# EAGLE schematic PROG (EAGLE 9.5.2)
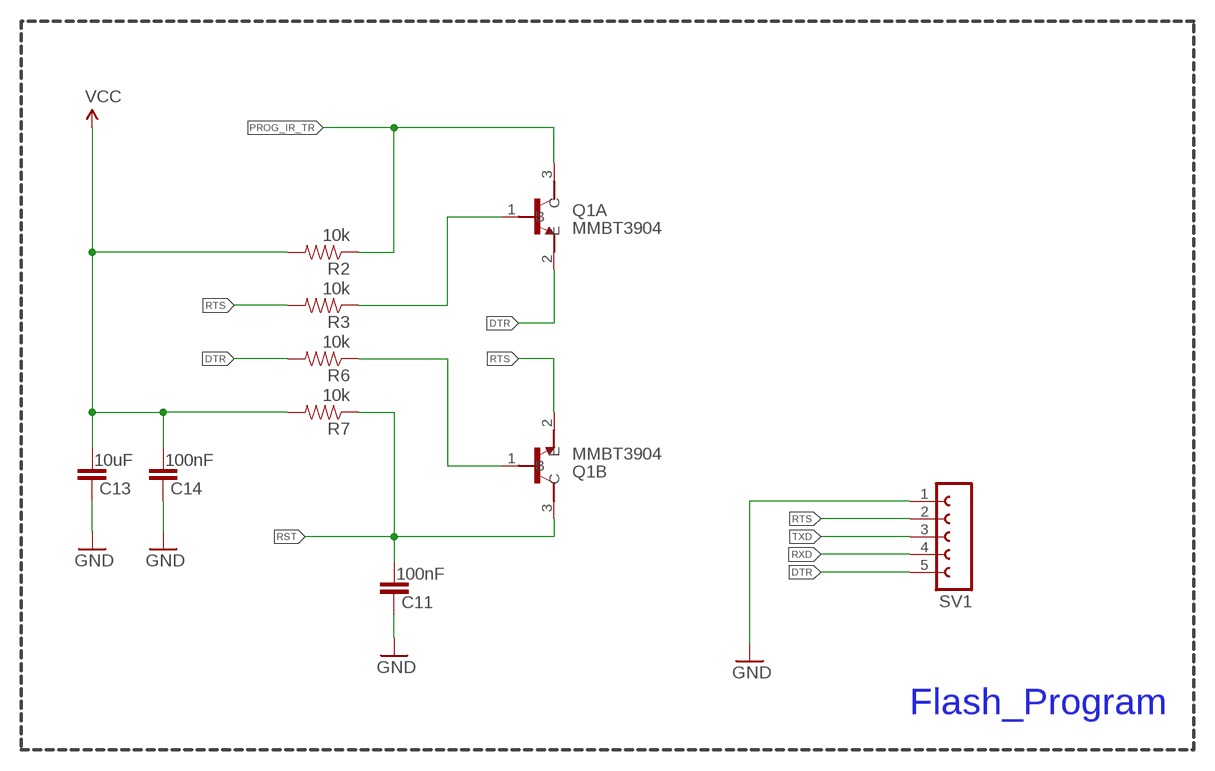
[diagram p0: schematic, sheet 1]

## Parts
C11  100nF  C-EUC0805  [C0805]
C13  10uF  C-EUC0805  [C0805]
C14  100nF  C-EUC0805  [C0805]
Q1A  MMBT3904  [SOT95P240X120-3N]
Q1B  MMBT3904  [SOT95P240X120-3N]
R2  10k  SPARKFUN_RESISTOR0805-RES  [SPARKFUN_0805]
R3  10k  SPARKFUN_RESISTOR0805-RES  [SPARKFUN_0805]
R6  10k  SPARKFUN_RESISTOR0805-RES  [SPARKFUN_0805]
R7  10k  SPARKFUN_RESISTOR0805-RES  [SPARKFUN_0805]
SV1  FE05-1  [FE05-1]

## Nets
DTR: Q1A.2(E) R6.2 SV1.5
GND: C11.1 C13.1 C14.1 SV1.1
N$5: Q1A.1(B) R3.1
N$6: Q1B.1(B) R6.1
PROG_IR_TR: Q1A.3(C) R2.1
RST: C11.2 Q1B.3(C) R7.1
RTS: Q1B.2(E) R3.2 SV1.2
RXD: SV1.4
TXD: SV1.3
VCC: C13.2 C14.2 R2.2 R7.2

## Notes on the sheet
- Flash_Program

## Library data of the parts
C11 C13 C14 = rcl:C-EU: CAPACITOR, European symbol; SPICEPREFIX: C
Q1A Q1B = MMBT3904:MMBT3904: MMBT3904 Series 40 V CE Breakdown 0.2 A NPN General Purpose Amplifier - SOT-23; AVAILABILITY: Unavailable; DESCRIPTION: Bipolar _BJT_ Transistor NPN 40V 200mA 270MHz 350mW Surface Mount SOT-23-3; MF: STMicroelectronics; MP: MMBT3904; PACKAGE: SOT-23-3 Taiwan Semiconductor; PRICE: None
R2 R3 R6 R7 = antduino:SPARKFUN_RESISTOR: Resistor Basic schematic elements and footprints for 0603, 1206, and PTH resistors.
SV1 = con-lsta:FE05-1: FEMALE HEADER; OC_FARNELL: unknown; OC_NEWARK: unknown